# EAGLE design Unit6802_Elektor (EAGLE 7.2.0)
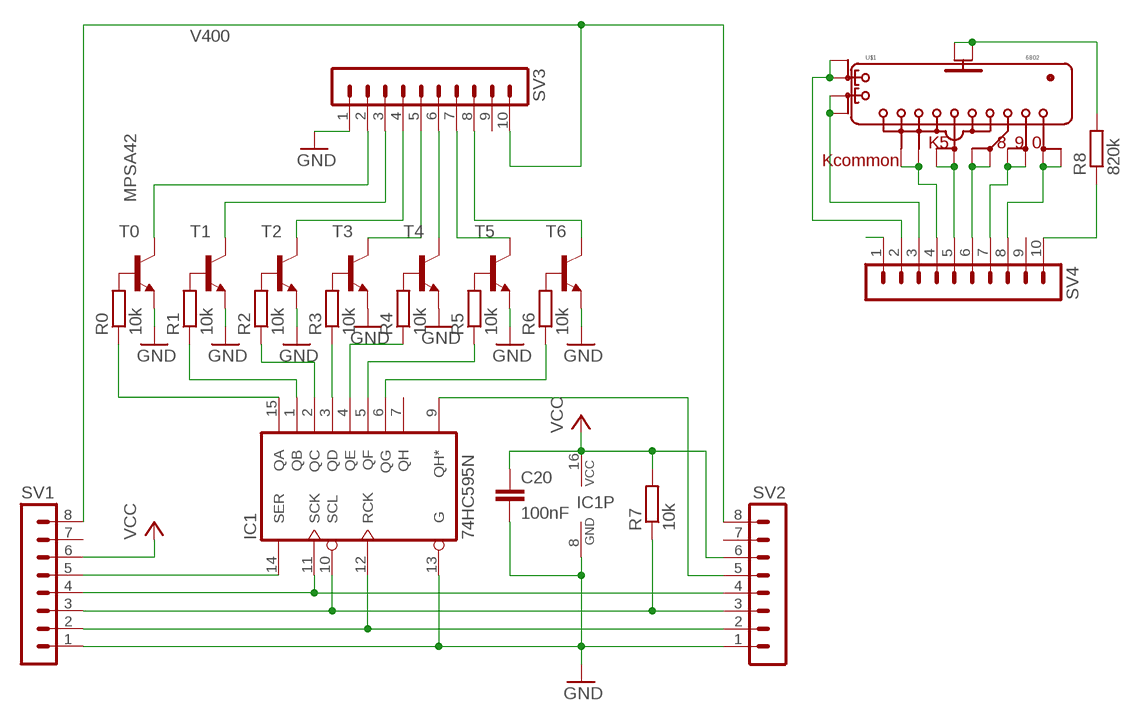
[diagram p0: schematic, sheet 1]

## Parts
C20  100nF  C-EU050-024X044  [C050-024X044]
IC1  74HC595N  [DIL16]
R0  10k  R-EU_0207/12  [0207/12]
R1  10k  R-EU_0207/12  [0207/12]
R2  10k  R-EU_0207/12  [0207/12]
R3  10k  R-EU_0207/12  [0207/12]
R4  10k  R-EU_0207/12  [0207/12]
R5  10k  R-EU_0207/12  [0207/12]
R6  10k  R-EU_0207/12  [0207/12]
R7  10k  R-EU_0207/12  [0207/12]
R8  820k  R-EU_0207/12  [0207/12]
SV1  MA08-1  [MA08-1]
SV2  MA08-1  [MA08-1]
SV3  MA10-1  [MA10-1]
SV4  MA10-1  [MA10-1]
T0  MPSA42  MPSA42-NPN-TO92-EBC  [TO92-EBC]
T1  MPSA42-NPN-TO92-EBC  [TO92-EBC]
T2  MPSA42-NPN-TO92-EBC  [TO92-EBC]
T3  MPSA42-NPN-TO92-EBC  [TO92-EBC]
T4  MPSA42-NPN-TO92-EBC  [TO92-EBC]
T5  MPSA42-NPN-TO92-EBC  [TO92-EBC]
T6  MPSA42-NPN-TO92-EBC  [TO92-EBC]
U$1  6802  6802OCTAL2  [OCTAL2]

## Nets
GND: C20.2 IC1.8(GND) IC1.13(G) SV1.1 SV2.1 SV3.1 T0.E T1.E T2.E T3.E T4.E T5.E T6.E
GND1: SV4.1
N$1: SV3.4 T2.C
N$2: SV3.5 T3.C
N$3: SV3.8 T6.C
N$4: SV3.7 T5.C
N$5: SV3.6 T4.C
N$6: SV3.2 T0.C
N$7: SV3.3 T1.C
N$8: SV4.4 U$1.1B(KCOMB) U$1.1C(KCOMA)
N$9: IC1.15(QA) R0.1
N$10: IC1.1(QB) R1.1
N$11: IC1.2(QC) R2.1
N$12: IC1.3(QD) R3.1
N$13: IC1.4(QE) R4.1
N$14: IC1.5(QF) R5.1
N$15: IC1.6(QG) R6.1
N$16: R1.2 T1.B
N$17: R2.2 T2.B
N$18: R3.2 T3.B
N$19: R4.2 T4.B
N$20: R5.2 T5.B
N$21: R6.2 T6.B
N$22: R0.2 T0.B
N$25: R8.1 SV4.10
N$26: IC1.14(SER) SV1.5
N$27: IC1.11(SCK) SV1.4 SV2.4
N$28: IC1.9(QH*) SV2.5
N$29: IC1.10(SCL) R7.1 SV1.3 SV2.3
N$30: IC1.12(RCK) SV1.2 SV2.2
N$32: SV4.5 U$1.2B(K5B) U$1.2C(K5A)
N$33: SV4.6 U$1.8B(K8B) U$1.8C(K8A)
N$34: SV4.7 U$1.6B(K9B) U$1.6C(K9A)
N$35: SV4.8 U$1.7B(K0B) U$1.7C(K0A)
N$36: SV4.3 U$1.5B(G2B) U$1.5C(G2A)
N$37: SV4.2 U$1.3B(G1B) U$1.3C(G1A)
N$38: R8.2 U$1.4B(ANODEB) U$1.4C(ANODEA)
V400: SV1.8 SV2.8 SV3.10
VCC: C20.1 IC1.16(VCC) R7.2 SV1.6 SV2.6
Unconnected: IC1.7(QH) SV1.7 SV2.7 SV3.9 SV4.9

## Library data of the parts
C20 = rcl:C-EU: CAPACITOR, European symbol
IC1 = 74xx-eu:74*595: 8-bit SHIFT REGISTER, output latch
R0 R1-R8 = rcl:R-EU_: RESISTOR, European symbol
SV1 SV2 = con-lstb:MA08-1: PIN HEADER; OC_FARNELL: unknown; OC_NEWARK: unknown
SV3 SV4 = con-lstb:MA10-1: PIN HEADER; OC_FARNELL: unknown; OC_NEWARK: unknown
T0 T1-T6 = transistor:*-NPN-: NPN Transistror BF959 corrected 2008.03.06
U$1 = 6802 Dekatron Decatron:6802: 6802 Dekatron with Octal socket Cathodes: 5, 8, 9, 0 and common

## Board
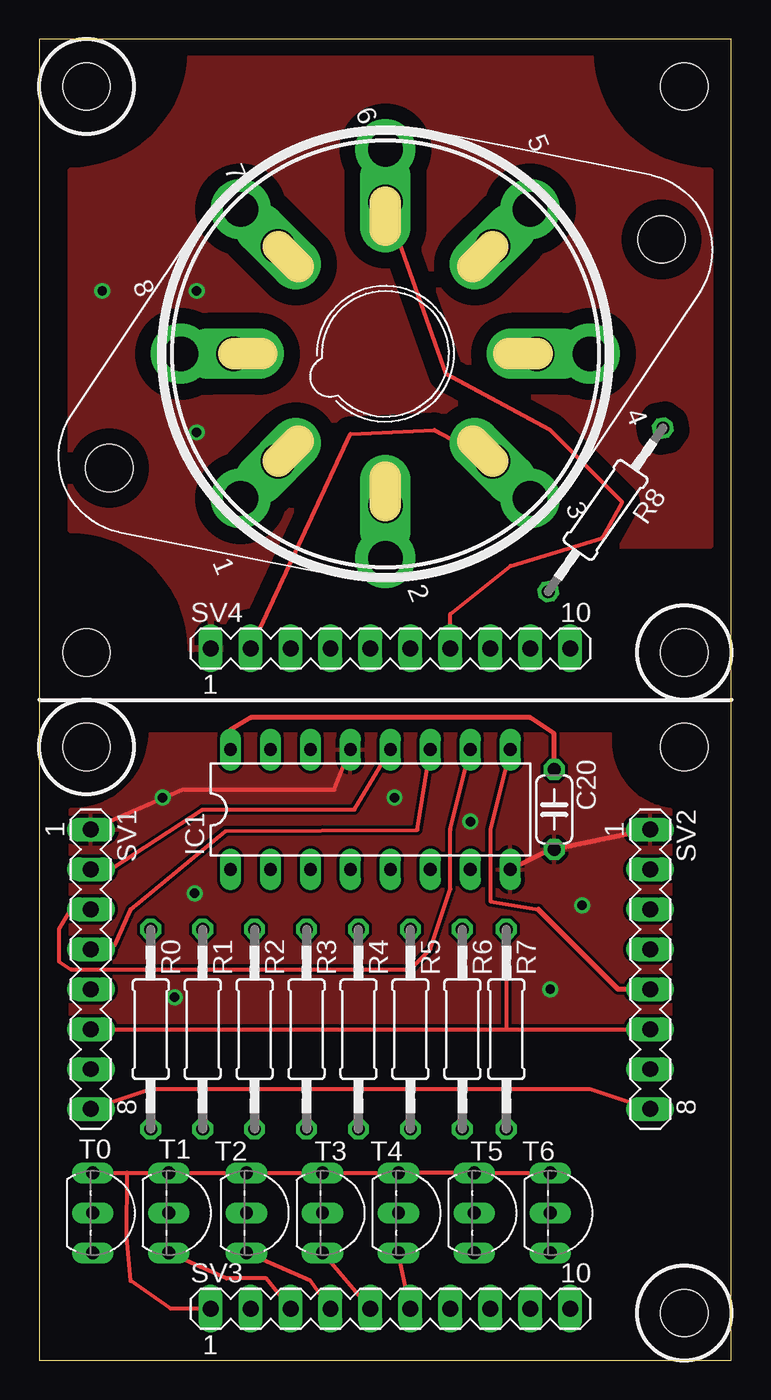
[diagram p1: board, top side]
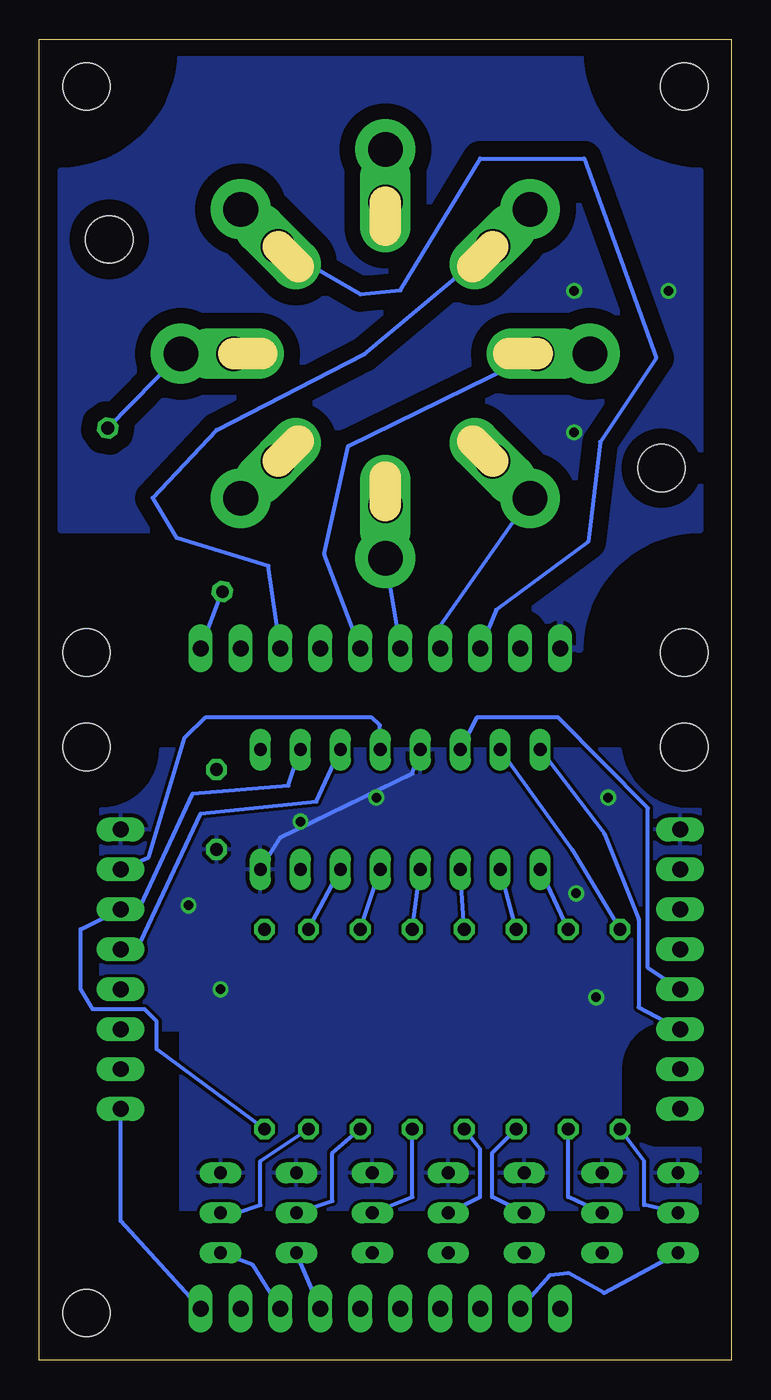
[diagram p2: board, bottom side, seen from below]

Size 44 x 84 mm. Coordinates in mm from the lower left corner, seen from the top.
Outline: 0,0 44,0 44,84 0,84 0,0
Copper layers (1*16): Top 0.035mm / dielectric 1.5mm / Bottom 0.035mm
Design rules "default *": minimum track width 10mil, minimum drill 0.6mm, track to track 8mil, track to pad 8mil, pad to pad 8mil, via to via 8mil, smd to smd 8mil, copper to edge 40mil, drill to drill 8mil, minimum pad ring 10mil, minimum via ring 8mil, stop-mask expansion 4mil, vias tented up to drill 0mil, thermal gap 10mil
Holes 3 mm at 41,3 3,39 41,45 3,81 41,39 41,81 3,45

### Footprints (pad centres in the part's own frame; a part is rotated, then mirrored left to right if it is on the bottom)
C050-024X044 = drill 0.813 octagon: 1 -2.54,0; 2 2.54,0
DIL16 = drill 0.813 long: 1 -8.89,-3.81; 2 -6.35,-3.81; 3 -3.81,-3.81; 4 -1.27,-3.81; 5 1.27,-3.81; 6 3.81,-3.81; 7 6.35,-3.81; 8 8.89,-3.81; 9 8.89,3.81; 10 6.35,3.81; 11 3.81,3.81; 12 1.27,3.81; 13 -1.27,3.81; 14 -3.81,3.81; 15 -6.35,3.81; 16 -8.89,3.81
0207/12 = drill 0.813 octagon: 1 -6.35,0; 2 6.35,0
MA08-1 = drill 1.016 long: 1 -8.89,0; 2 -6.35,0; 3 -3.81,0; 4 -1.27,0; 5 1.27,0; 6 3.81,0; 7 6.35,0; 8 8.89,0
MA10-1 = drill 1.016 long: 1 -11.43,0; 2 -8.89,0; 3 -6.35,0; 4 -3.81,0; 5 -1.27,0; 6 1.27,0; 7 3.81,0; 8 6.35,0; 9 8.89,0; 10 11.43,0
TO92-EBC = drill 0.813 long: B 0,-1.27; C 2.54,-1.27; E -2.54,-1.27
OCTAL2 = drill 2.2 long: 1B -6.824,-6.824; 2B 0,-9.65; 3B 6.824,-6.824; 4B 9.65,0; 5B 6.824,6.824; 6B 0,9.65; 7B -6.824,6.824; 8B -9.65,0 | drill 2.2 pad 3.81: 1C -9.192,-9.192; 2C 0,-13; 3C 9.192,-9.192; 4C 13,0; 5C 9.192,9.192; 6C 0,13; 7C -9.192,9.192; 8C -13,0 | hole 3: -17.554,-7.271; 17.554,7.271

### Placement (x,y rotation side)
C20  32.73,35.02 270 top
IC1  21.05,35.02 0 top
R0  7.08,21.05 270 top
R1  10.38,21.05 270 top
R2  13.68,21.05 270 top
R3  16.99,21.05 270 top
R4  20.29,21.05 270 top
R5  23.59,21.05 270 top
R6  26.89,21.05 270 top
R7  29.69,21.05 90 top
R8  36,54.07 55 top
SV1  3.27,24.86 270 top
SV2  38.83,24.86 270 top
SV3  22.32,3.27 0 top
SV4  22.32,45.27 0 top
T0  4.67,9.37 270 top
T1  9.49,9.37 270 top
T2  14.45,9.37 270 top
T3  19.27,9.37 270 top
T4  24.1,9.37 270 top
T5  28.92,9.37 270 top
T6  33.75,9.37 270 top
U$1  22,64 0 top

### Tracks (layer width: path | path; a pad name or v marks a point on that pad's centre or on a via)
GND  (via drill 0.6)
  Top 0.254: T0.E 5.58,11.93 | 5.58,11.93 T1.E T2.E T3.E T4.E T5.E T6.E | IC1.13 18.76,36.29 9.11,36.29 SV1.1 | SV3.1 8.35,3.27 5.81,5.05 5.56,7.84 5.58,11.93
  Top 0.305: IC1.8 32.48,32.48 C20.2 SV2.1
  Bottom 0.254: IC1.8 28.67,33.24 20.29,37.31 IC1.13
  other vias: 32.48,23.59 8.6,23.08 9.87,29.69 22.57,35.78 7.84,35.78 34.51,28.92 27.4,34.26
  pour Top: 7.08,39.83 36.29,39.83 arc90 40.1,35.02 40.1,19.78 2,19.78 2,35.02 arc90
  pour Bottom: 7.08,38.83 36.29,38.83 arc90 40.1,35.02 40.1,21.05 35.02,21.05 35.02,9.62 2,9.62 2,13.43 4.54,13.43 arc90 7.08,15.97 7.08,18.51 arc127 2,21.05 2,35.02 arc90
GND1  (via drill 0.6)
  other vias: 4,68 10,68 10,59
  pour Bottom (isolate 1): 9.62,83.28 35.02,83.28 arc90 42.64,75.66 42.64,52.8 31.8,52.8 29,50 29.02,45.18 9.62,45.18 arc90 2,52.8 2,75.66 arc90
  pour Top (isolate 1): 9.62,83.28 35.02,83.28 arc90 42.64,75.66 42.64,51.8 31.8,51.8 29,50 29.02,45.18 9.62,45.18 arc90 2,52.8 2,75.66 arc90
N$1
  Top 0.254: SV3.4 17.24,5.05 T2.C
N$2
  Top 0.254: SV3.5 T3.C
N$3
  Bottom 0.254: SV3.8 30.45,6.06 T6.C
N$4
  Bottom 0.254: SV3.7 T5.C
N$5
  Top 0.254: SV3.6 T4.C
N$6
  Bottom 0.254: SV3.2 11.54,5.42 10.38,5.56 8.1,4.29 T0.C
N$7
  Top 0.254: SV3.3 14.44,5.2 11.89,5.2 T1.C
N$8
  Bottom 0.254: U$1.1B U$1.1C 18.51,46.7 SV4.4
N$9
  Bottom 0.254: R0.1 10.13,32.48 IC1.15
N$10
  Bottom 0.254: R1.1 IC1.1
N$11
  Bottom 0.254: R2.1 IC1.2
N$12
  Bottom 0.254: R3.1 IC1.3
N$13
  Bottom 0.254: R4.1 IC1.4
N$14
  Bottom 0.254: R5.1 IC1.5
N$15
  Bottom 0.254: R6.1 IC1.6
N$16
  Bottom 0.254: T1.B 10.38,10.38 R1.2
N$17
  Bottom 0.254: T2.B 15.21,10.38 15.21,13.18 R2.2
N$18
  Bottom 0.254: T3.B 15.97,10.38 15.97,13.43 R3.2
N$19
  Bottom 0.254: T4.B 20.29,10.38 R4.2
N$20
  Bottom 0.254: T5.B 25.37,10.13 25.37,13.18 R5.2
N$21
  Bottom 0.254: T6.B 31.46,9.37 29.94,9.87 29.94,12.67 R6.2
N$22
  Bottom 0.254: T0.B 5.56,9.87 5.56,12.67 R0.2
N$25
  Bottom 0.254: SV4.10 R8.1
N$26
  Bottom 0.254: SV1.5 5.31,24.95 5.31,35.11 11.01,40.86 16.2,40.86 IC1.14
N$27
  Top 0.254: SV1.4 4.79,26.38 5.81,28.67 11.84,33.65 24.03,33.73 IC1.11
  Bottom 0.254: SV2.4 37.56,26.64 33.75,34.77 26.38,35.53 IC1.11
N$28
  Top 0.254: IC1.9 28.67,33.75 28.67,29.18 31.72,28.67
  Top 0.305: SV2.5 36.8,23.59 31.72,28.67
N$29
  Top 0.254: SV1.3 2,28.67 1.24,27.4 1.24,25.37 2,24.86 23.59,24.86 24.86,26.13 26.13,29.94 26.13,33.75 IC1.10
  Bottom 0.254: IC1.10 28.16,36.54 34.26,36.04 37.56,28.92 SV2.3 41.37,27.4 41.37,23.59 40.61,22.32 37.31,22.32 36.54,21.56 36.54,19.78 R7.1
N$30
  Top 0.254: SV1.2 4.54,31.21 10.38,35.02 20.03,35.02 IC1.12
  Bottom 0.254: SV2.2 37.05,31.97 34.77,39.59 33.46,40.86 22.86,40.86 22.35,40.39 22.35,38.83 IC1.12
N$32
  Bottom 0.254: U$1.2B U$1.2C SV4.5
N$33
  Bottom 0.254: U$1.8C U$1.8B 24.35,58.13 25.88,51.28 SV4.6
N$34
  Top 0.254: U$1.6B 25.88,62.71 32.48,59.15 37.05,54.58 35.78,52.29 29.94,50.51 26.13,47.47 SV4.7
  Bottom 0.254: U$1.6C U$1.6B
N$35
  Bottom 0.254: U$1.7C U$1.7B 23.34,63.98 32.73,59.15 36.8,54.83 35.27,52.29 29.43,50.51 SV4.8
N$36
  Bottom 0.254: U$1.5C U$1.5B 23.59,67.79 21.05,68.04 15.97,76.42 9.37,76.42 4.79,63.72 8.35,58.39 9.11,52.04 14.95,47.72 SV4.3
N$37
  Top 0.254: SV4.2 19.78,58.9 25.11,59.15 U$1.3B U$1.3C
N$38
  Bottom 0.254: R8.2 U$1.4C U$1.4B
V400
  Top 0.254: SV1.8 7.08,17.24 35.02,17.24 SV2.8
  Bottom 0.254: SV3.10 38.83,8.86 SV2.8
VCC
  Top 0.254: SV1.6 29.69,21.05 | 29.69,21.05 SV2.6 | R7.2 29.69,21.05
  Top 0.305: C20.1 32.73,39.85 31.21,40.86 13.43,40.86 12.16,40.1 IC1.16
  Bottom 0.254: IC1.16 8.1,33.5 5.9,28.03 5.9,22.44 SV1.6